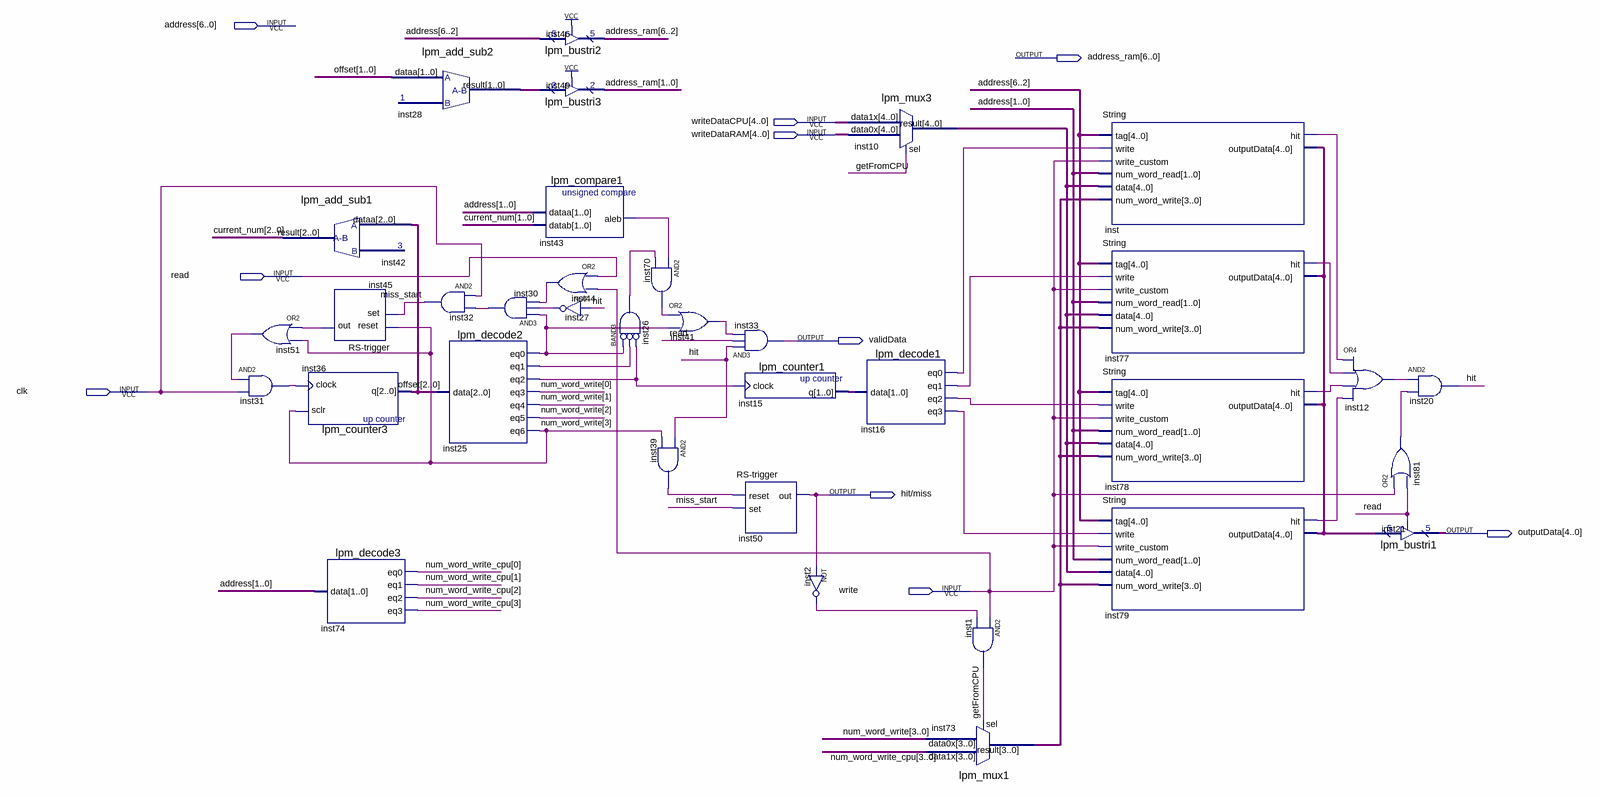
[diagram p0: schematic sheet]
// Quartus schematic Cache.bdf as structural Verilog: 35 symbols, 10 pins
module Cache (
  input  [6:0] address,
  input  [4:0] writeDataCPU,
  input  [4:0] writeDataRAM,
  input  read,
  input  clk,
  input  write,
  output [6:0] address_ram,
  output validData,
  output \hit/miss ,
  output [4:0] outputData
);

  wire getFromCPU, hit, inst2_out, inst12_out, inst16_eq0, inst16_eq1, inst16_eq2, inst16_eq3, inst25_eq0,
       inst25_eq1, inst25_eq2, inst26_out, inst27_out, inst30_out, inst31_out, inst39_out, inst41_out,
       inst43_aleb, inst44_out, inst45_out, inst51_out, inst70_out, inst77_hit, inst78_hit, inst79_hit,
       inst81_out, inst_hit, miss_start;
  wire [1:0] inst15_q, inst28_result;
  wire [2:0] current_num, offset;
  wire [3:0] inst73_result, num_word_write, num_word_write_cpu;
  wire [4:0] inst10_result, inst_outputdata;

  or inst51 (inst51_out, inst45_out, num_word_write[3]);
  and inst31 (inst31_out, inst51_out, clk);
  lpm_add_sub1 inst42 (.dataa(offset), .result(current_num));
  lpm_counter3 inst36 (.sclr(num_word_write[3]), .clock(inst31_out), .q(offset));
  \RS-trigger  inst45 (.reset(num_word_write[3]), .set(miss_start), .out(inst45_out));
  lpm_decode3 inst74 (
    .data(address[1:0]), .eq0(num_word_write_cpu[0]), .eq1(num_word_write_cpu[1]),
    .eq2(num_word_write_cpu[2]), .eq3(num_word_write_cpu[3]));
  lpm_add_sub2 inst28 (.dataa(offset[1:0]), .result(inst28_result));
  and inst32 (miss_start, clk, inst30_out);
  lpm_decode2 inst25 (
    .data(offset), .eq0(inst25_eq0), .eq1(inst25_eq1), .eq2(inst25_eq2), .eq3(num_word_write[0]),
    .eq4(num_word_write[1]), .eq5(num_word_write[2]), .eq6(num_word_write[3]));
  and inst30 (inst30_out, inst25_eq0, inst27_out, inst44_out);
  lpm_bustri2 inst46 (.enabledt(1'b1), .data(address[6:2]), .tridata(address_ram[6:2]));
  lpm_bustri3 inst49 (.enabledt(1'b1), .data(inst28_result), .tridata(address_ram[1:0]));
  lpm_compare1 inst43 (.dataa(address[1:0]), .datab(current_num[1:0]), .aleb(inst43_aleb));
  or inst44 (inst44_out, read, write);
  not inst27 (inst27_out, hit);
  and inst26 (inst26_out, ~inst25_eq0, ~inst25_eq1, ~inst25_eq2);  // BAND3
  and inst70 (inst70_out, inst43_aleb, inst26_out);
  or inst41 (inst41_out, inst70_out, inst25_eq0);
  and inst39 (inst39_out, hit, num_word_write[3]);
  and inst33 (validData, hit, read, inst41_out);
  lpm_counter1 inst15 (.clock(inst25_eq2), .q(inst15_q));
  \RS-trigger  inst50 (.reset(inst39_out), .set(miss_start), .out(\hit/miss ));
  not inst2 (inst2_out, \hit/miss );
  lpm_mux3 inst10 (.data1x(writeDataCPU), .data0x(writeDataRAM), .sel(getFromCPU), .result(inst10_result));
  lpm_decode1 inst16 (.data(inst15_q), .eq0(inst16_eq0), .eq1(inst16_eq1), .eq2(inst16_eq2), .eq3(inst16_eq3));
  lpm_mux1 inst73 (.data1x(num_word_write_cpu), .data0x(num_word_write), .sel(getFromCPU), .result(inst73_result));
  and inst1 (getFromCPU, write, inst2_out);
  String inst (
    .tag(address[6:2]), .write(inst16_eq0), .write_custom(write), .num_word_read(address[1:0]),
    .data(inst10_result), .num_word_write(inst73_result), .hit(inst_hit), .outputData(inst_outputdata));
  String inst77 (
    .tag(address[6:2]), .write(inst16_eq1), .write_custom(write), .num_word_read(address[1:0]),
    .data(inst10_result), .num_word_write(inst73_result), .hit(inst77_hit), .outputData(inst_outputdata));
  String inst78 (
    .tag(address[6:2]), .write(inst16_eq2), .write_custom(write), .num_word_read(address[1:0]),
    .data(inst10_result), .num_word_write(inst73_result), .hit(inst78_hit), .outputData(inst_outputdata));
  String inst79 (
    .tag(address[6:2]), .write(inst16_eq3), .write_custom(write), .num_word_read(address[1:0]),
    .data(inst10_result), .num_word_write(inst73_result), .hit(inst79_hit), .outputData(inst_outputdata));
  or inst12 (inst12_out, inst_hit, inst77_hit, inst78_hit, inst79_hit);
  or inst81 (inst81_out, write, read);
  lpm_bustri1 inst21 (.enabledt(read), .data(inst_outputdata), .tridata(outputData));
  and inst20 (hit, inst12_out, inst81_out);
endmodule
